# Altium schematic sheet Navigation.SchDoc
size A
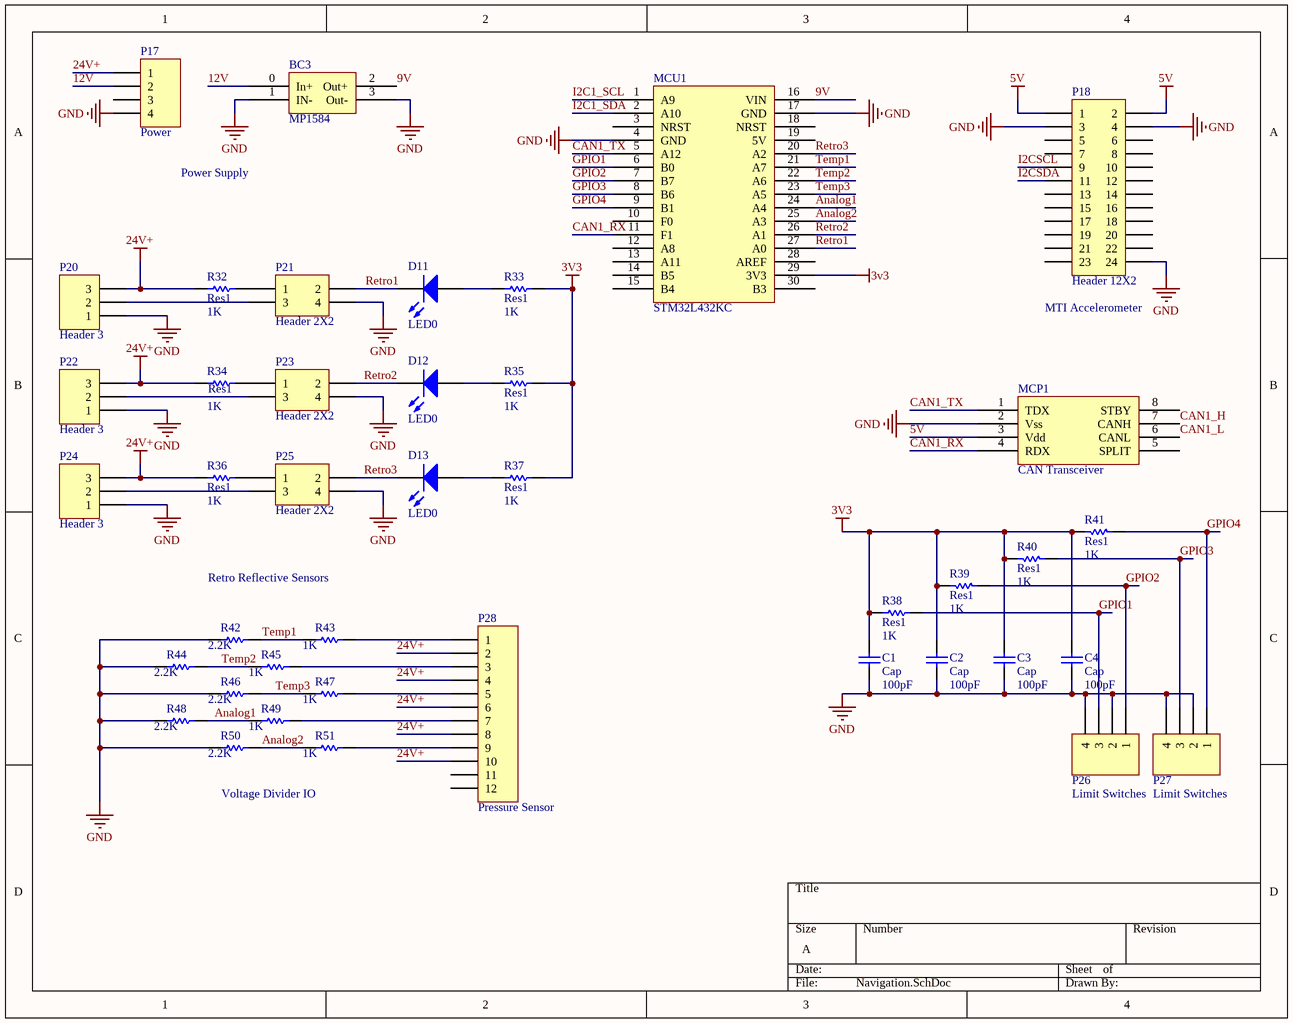
[diagram p0: Navigation.SchDoc]

## Parts
BC3  MP1584
C1  Cap  value 100pF  [SMD Capacitor]
C2  Cap  value 100pF  [SMD Capacitor]
C3  Cap  value 100pF  [SMD Capacitor]
C4  Cap  value 100pF  [SMD Capacitor]
D11  LED0  [LED-0]
D12  LED0  [LED-0]
D13  LED0  [LED-0]
MCP1  CAN Transceiver
MCU1  STM32L432KC
P17  Power  [HDR1X4]
P18  Header 12X2  [HDR2X12]
P20  Header 3  [HDR1X3]
P21  Header 2X2  [HDR2X2]
P22  Header 3  [HDR1X3]
P23  Header 2X2  [HDR2X2]
P24  Header 3  [HDR1X3]
P25  Header 2X2  [HDR2X2]
P26  Limit Switches  [HDR1X4]
P27  Limit Switches  [HDR1X4]
P28  Pressure Sensor  [HDR1X12]
R32  Res1  value 1K  [SMD Resistor]
R33  Res1  value 1K  [SMD Resistor]
R34  Res1  value 1K  [SMD Resistor]
R35  Res1  value 1K  [SMD Resistor]
R36  Res1  value 1K  [SMD Resistor]
R37  Res1  value 1K  [SMD Resistor]
R38  Res1  value 1K  [SMD Resistor]
R39  Res1  value 1K  [SMD Resistor]
R40  Res1  value 1K  [SMD Resistor]
R41  Res1  value 1K  [SMD Resistor]
R42  value 2.2K  [SMD Resistor]  (hidden comment: Res1)
R43  value 1K  [SMD Resistor]  (hidden comment: Res1)
R44  value 2.2K  [SMD Resistor]  (hidden comment: Res1)
R45  value 1K  [SMD Resistor]  (hidden comment: Res1)
R46  value 2.2K  [SMD Resistor]  (hidden comment: Res1)
R47  value 1K  [SMD Resistor]  (hidden comment: Res1)
R48  value 2.2K  [SMD Resistor]  (hidden comment: Res1)
R49  value 1K  [SMD Resistor]  (hidden comment: Res1)
R50  value 2.2K  [SMD Resistor]  (hidden comment: Res1)
R51  value 1K  [SMD Resistor]  (hidden comment: Res1)

## Nets
3V3: C1.2 C2.2 C3.2 C4.2 MCU1.29(3V3) R33.2 R35.2 R37.2 R38.1 R39.2 R40.2 R41.2
5V: MCP1.3(Vdd) P18.1 P18.2
24V+: P17.1 P20.3 P22.3 P24.3 P28.2 P28.4 P28.6 P28.8 P28.10 R32.1 R34.1 R36.1
GND: BC3.1(IN-) BC3.3(Out-) C1.1 C2.1 C3.1 C4.1 MCP1.2(Vss) MCU1.4(GND) MCU1.17(GND) P17.4 P18.3 P18.4 P18.24 P20.1 P21.4 P22.1 P23.4 P24.1 P25.4 P26.2 P26.4 P27.2 P27.4 R42.1 R44.1 R46.1 R48.1 R50.1
9V: BC3.2(Out+) MCU1.16(VIN)
12V: BC3.0(In+) P17.2
Analog1: MCU1.24(A4) R48.2 R49.1
Analog2: MCU1.25(A3) R50.2 R51.1
CAN1_H: MCP1.7(CANH)
CAN1_L: MCP1.6(CANL)
CAN1_RX: MCP1.4(RDX) MCU1.11(F1)
CAN1_TX: MCP1.1(TDX) MCU1.5(A12)
GPIO1: MCU1.6(B0) P26.3 R38.2
GPIO2: MCU1.7(B7) P26.1 R39.1
GPIO3: MCU1.8(B6) P27.3 R40.1
GPIO4: MCU1.9(B1) P27.1 R41.1
I2C1_SCL: MCU1.1(A9)
I2C1_SDA: MCU1.2(A10)
I2CSCL: P18.9
I2CSDA: P18.11
Retro1: D11.2(K) MCU1.27(A0) P21.2
Retro2: D12.2(K) MCU1.26(A1) P23.2
Retro3: D13.2(K) MCU1.20(A2) P25.2
Temp1: MCU1.21(A7) R42.2 R43.1
Temp2: MCU1.22(A6) R44.2 R45.1
Temp3: MCU1.23(A5) R46.2 R47.1
NetD11_1: D11.1(A) R33.1
NetD12_1: D12.1(A) R35.1
NetD13_1: D13.1(A) R37.1
NetP20_2: P20.2 P21.3
NetP21_1: P21.1 R32.2
NetP22_2: P22.2 P23.3
NetP23_1: P23.1 R34.2
NetP24_2: P24.2 P25.3
NetP25_1: P25.1 R36.2
NetP28_1: P28.1 R43.2
NetP28_3: P28.3 R45.2
NetP28_5: P28.5 R47.2
NetP28_7: P28.7 R49.2
NetP28_9: P28.9 R51.2

Not connected (* = marked no-connect by the designer): MCP1 5(SPLIT) 8(STBY); MCU1 3(NRST) 10(F0) 12(A8) 13(A11) 14(B5) 15(B4) 18(NRST) 19(5V) 28(AREF) 30(B3); P17 3; P18 5 6 7 8 10 12 13 14 15 16 17 18 19 20 21 22 23; P28 11 12

## Notes on the sheet
- Power Supply
- (near P18) MTI Accelerometer
- Retro Reflective Sensors
- Voltage Divider IO

## Library data of the parts
C1-C4 = Cap: Capacitor; Published: 8-Jun-2000; LatestRevisionDate: 17-Jul-2002; LatestRevisionNote: Re-released for DXP Platform.; PackageReference: RAD-0.3; Publisher: Altium Limited; PackageDescription: Radial Cap, Thru-Hole; 2 Leads; 0.3 in Pin Spacing
D11-D13 = LED0: Typical INFRARED GaAs LED; Published: 8-Jun-2000; LatestRevisionDate: 08-Jul-2005; LatestRevisionNote: Mech Layer 1 removed.; PackageReference: LED-0; Publisher: Altium Limited; PackageDescription: LED; 2 Leads
MCP1 = CAN_TRANS: ComponentLink1Description: MCP2557FD; ComponentLink1URL: https://www.mouser.com/productdetail/microchip-technology/mcp2557fd-h-sn?qs=sGAEpiMZZMsGqoCZrYwANkLWU4Se4IrDu%2FrtAtMTObg%3D
MCU1 = STMF303K8
P17 P26 P27 = Header 4: Header, 4-Pin; LatestRevisionDate: 17-Jul-2002; LatestRevisionNote: Re-released for DXP Platform.; Publisher: Altium Limited
P18 = Header 12X2: Header, 12-Pin, Dual row; LatestRevisionDate: 17-Jul-2002; LatestRevisionNote: Re-released for DXP Platform.; Publisher: Altium Limited
P20 P22 P24 = Header 3: Header, 3-Pin; LatestRevisionDate: 17-Jul-2002; LatestRevisionNote: Re-released for DXP Platform.; Publisher: Altium Limited
P21 P23 P25 = Header 2X2: Header, 2-Pin, Dual row; LatestRevisionDate: 17-Jul-2002; LatestRevisionNote: Re-released for DXP Platform.; Publisher: Altium Limited
P28 = Header 12: Header, 12-Pin; LatestRevisionDate: 17-Jul-2002; LatestRevisionNote: Re-released for DXP Platform.; Publisher: Altium Limited
R32-R51 = Res1: Resistor; Published: 8-Jun-2000; LatestRevisionDate: 17-Jul-2002; LatestRevisionNote: Re-released for DXP Platform.; PackageReference: AXIAL-0.3; Publisher: Altium Limited; PackageDescription: Axial Device, Thru-Hole; 2 Leads; 0.3 in Pin Spacing